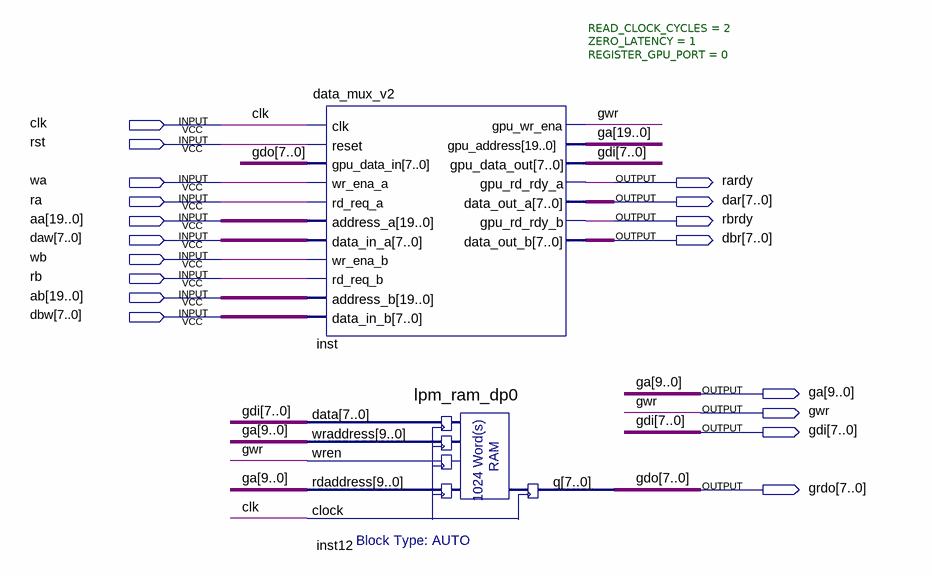
[diagram p0: schematic sheet]
// Quartus schematic Top.bdf as structural Verilog: 2 symbols, 18 pins
module Top (
  input  clk,
  input  rst,
  input  wa,
  input  ra,
  input  [19:0] aa,
  input  [7:0] daw,
  input  wb,
  input  rb,
  input  [19:0] ab,
  input  [7:0] dbw,
  output rardy,
  output [7:0] dar,
  output rbrdy,
  output [7:0] dbr,
  output [19:0] ga,
  output gwr,
  output [7:0] gdi,
  output [7:0] grdo
);

  data_mux_v2 #(.READ_CLOCK_CYCLES(2), .ZERO_LATENCY(1), .REGISTER_GPU_PORT(0)) inst (
    .clk(clk), .reset(rst), .gpu_data_in(grdo), .wr_ena_a(wa), .rd_req_a(ra), .address_a(aa),
    .data_in_a(daw), .wr_ena_b(wb), .rd_req_b(rb), .address_b(ab), .data_in_b(dbw), .gpu_wr_ena(gwr),
    .gpu_address(ga), .gpu_data_out(gdi), .gpu_rd_rdy_a(rardy), .data_out_a(dar), .gpu_rd_rdy_b(rbrdy),
    .data_out_b(dbr));
  lpm_ram_dp0 inst12 (.data(gdi), .wraddress(ga[9:0]), .wren(gwr), .rdaddress(ga[9:0]), .clock(clk), .q(grdo));

  // Other names for the same wires on the sheet: gdo[7:0] = grdo
endmodule
